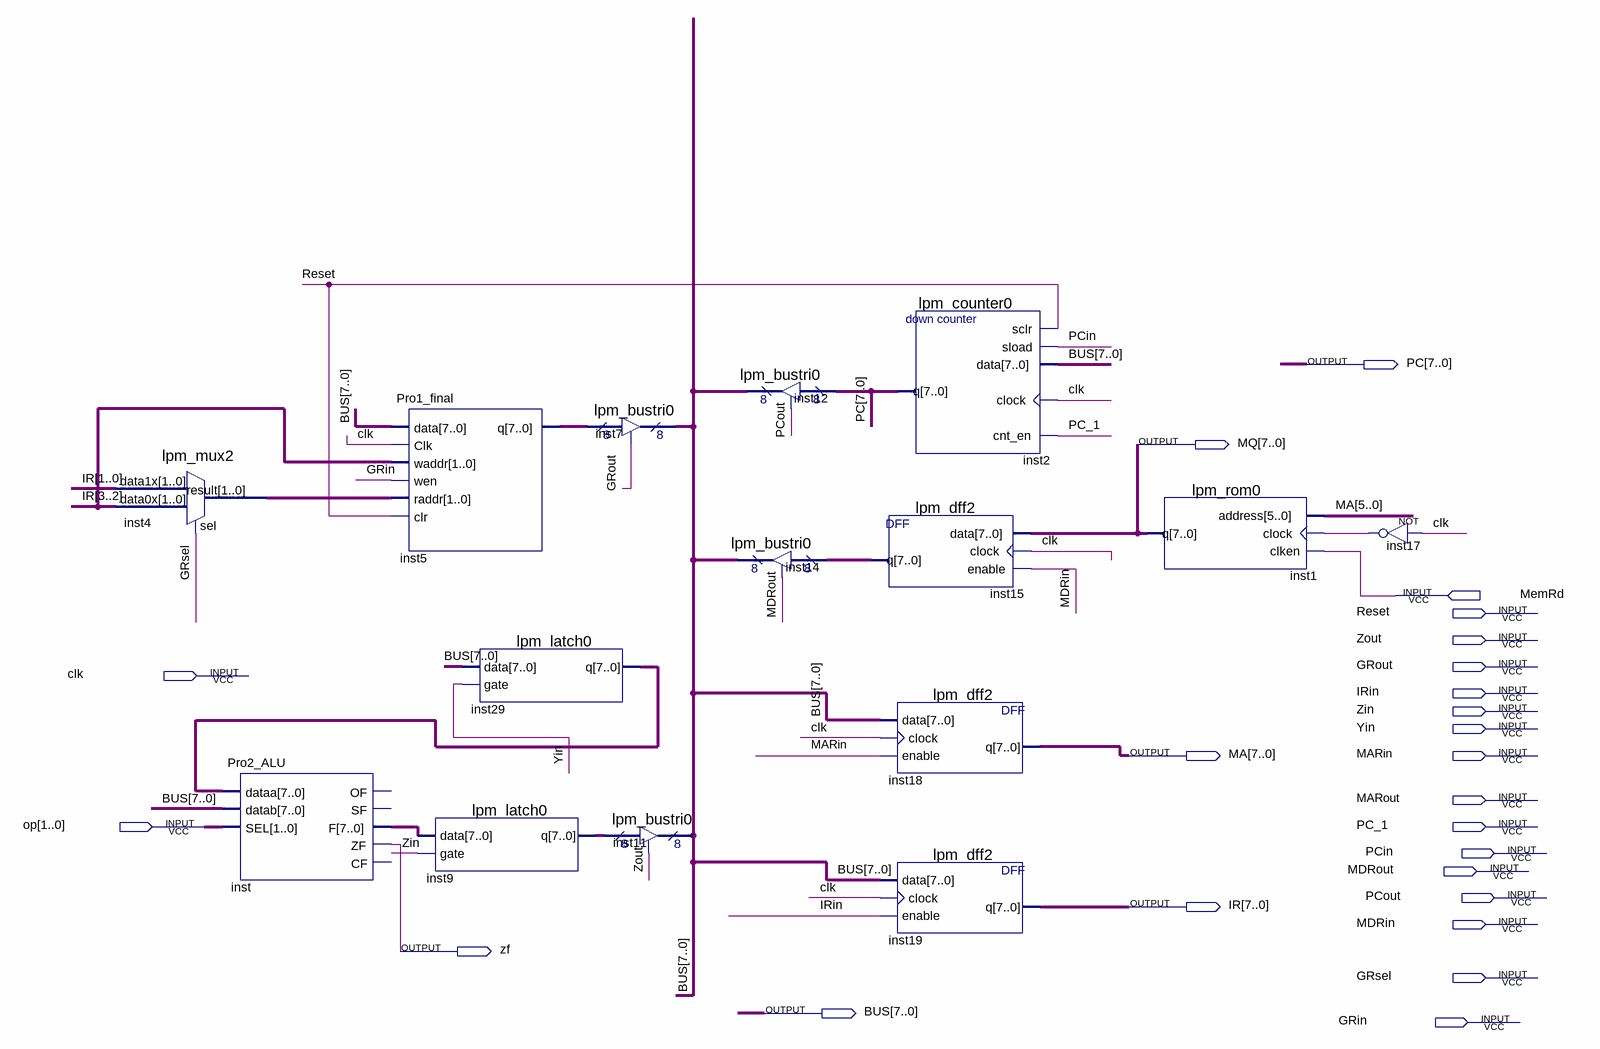
[diagram p0: schematic sheet]
// Quartus schematic Pro4.bdf as structural Verilog: 15 symbols, 24 pins
module Pro4 (
  input  MemRd,
  input  Reset,
  input  Zout,
  input  GRout,
  input  clk,
  input  IRin,
  input  Zin,
  input  Yin,
  input  MARin,
  input  MARout,
  input  [1:0] op,
  input  PC_1,
  input  PCin,
  input  MDRout,
  input  PCout,
  input  MDRin,
  input  GRsel,
  input  GRin,
  output [7:0] PC,
  output [7:0] MQ,
  output [7:0] MA,
  output [7:0] IR,
  output zf,
  output [7:0] BUS
);

  wire inst17_out;
  wire [1:0] inst4_result;
  wire [7:0] inst5_q, inst9_q, inst15_q, inst29_q, inst_f;

  lpm_mux2 inst4 (.data1x(IR[1:0]), .data0x(IR[3:2]), .sel(GRsel), .result(inst4_result));
  Pro2_ALU inst (.dataa(inst29_q), .datab(BUS), .SEL(op), .F(inst_f), .ZF(zf));  // open: OF, SF, CF
  Pro1_final inst5 (.data(BUS), .Clk(clk), .waddr(IR[3:2]), .wen(GRin), .raddr(inst4_result), .clr(Reset), .q(inst5_q));
  lpm_latch0 inst29 (.data(BUS), .gate(Yin), .q(inst29_q));
  lpm_latch0 inst9 (.data(inst_f), .gate(Zin), .q(inst9_q));
  lpm_bustri0 inst7 (.enabledt(GRout), .data(inst5_q), .tridata(BUS));
  lpm_bustri0 inst11 (.enabledt(Zout), .data(inst9_q), .tridata(BUS));
  lpm_bustri0 inst12 (.enabledt(PCout), .data(PC), .tridata(BUS));
  lpm_bustri0 inst14 (.enabledt(MDRout), .data(inst15_q), .tridata(BUS));
  lpm_counter0 inst2 (.sclr(Reset), .sload(PCin), .data(BUS), .clock(clk), .cnt_en(PC_1), .q(PC));
  lpm_dff2 inst15 (.data(MQ), .clock(clk), .enable(MDRin), .q(inst15_q));
  lpm_dff2 inst18 (.data(BUS), .clock(clk), .enable(MARin), .q(MA));
  lpm_dff2 inst19 (.data(BUS), .clock(clk), .enable(IRin), .q(IR));
  lpm_rom0 inst1 (.address(MA[5:0]), .clock(inst17_out), .clken(MemRd), .q(MQ));
  not inst17 (inst17_out, clk);
endmodule
